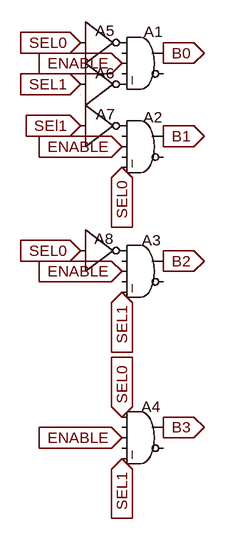
[diagram p0: schematic decoder_with_enable_2x4.asc]
decoder_with_enable_2x4.asc, the LTspice schematic file:
Version 4
SHEET 1 880 692
FLAG 176 -64 SEL0
IOPIN 176 -64 In
FLAG 240 128 SEL0
IOPIN 240 128 In
FLAG 176 256 SEL0
IOPIN 176 256 In
FLAG 240 512 SEL0
IOPIN 240 512 In
FLAG 176 0 SEL1
IOPIN 176 0 In
FLAG 176 64 SEl1
IOPIN 176 64 In
FLAG 240 320 SEL1
IOPIN 240 320 In
FLAG 240 576 SEL1
IOPIN 240 576 In
FLAG 240 -32 ENABLE
IOPIN 240 -32 In
FLAG 240 96 ENABLE
IOPIN 240 96 In
FLAG 240 288 ENABLE
IOPIN 240 288 In
FLAG 240 544 ENABLE
IOPIN 240 544 In
FLAG 304 -48 B0
IOPIN 304 -48 Out
FLAG 304 80 B1
IOPIN 304 80 Out
FLAG 304 272 B2
IOPIN 304 272 Out
FLAG 304 528 B3
IOPIN 304 528 Out
SYMBOL Digital\\and 272 -96 R0
WINDOW 0 2 15 Left 2
SYMATTR InstName A1
SYMBOL Digital\\and 272 32 R0
WINDOW 0 1 19 Left 2
SYMATTR InstName A2
SYMBOL Digital\\and 272 224 R0
WINDOW 0 -1 16 Left 2
SYMATTR InstName A3
SYMBOL Digital\\and 272 480 R0
WINDOW 0 -2 16 Left 2
SYMATTR InstName A4
SYMBOL Digital\\inv 176 -128 R0
WINDOW 0 23 46 Left 2
SYMATTR InstName A5
SYMBOL Digital\\inv 176 -64 R0
WINDOW 0 23 47 Left 2
SYMATTR InstName A6
SYMBOL Digital\\inv 176 0 R0
WINDOW 0 24 46 Left 2
SYMATTR InstName A7
SYMBOL Digital\\inv 176 192 R0
WINDOW 0 22 46 Left 2
SYMATTR InstName A8

The netlist it stands for:
* decoder_with_enable_2x4.asc
A1 P001 0 ENABLE 0 P002 0 B0 0 AND
A2 P003 0 ENABLE 0 SEL0 0 B1 0 AND
A3 P004 0 ENABLE 0 SEL1 0 B2 0 AND
A4 SEL0 0 ENABLE 0 SEL1 0 B3 0 AND
A5 SEL0 0 0 0 0 P001 0 0 BUF
A6 SEL1 0 0 0 0 P002 0 0 BUF
A7 SEL1 0 0 0 0 P003 0 0 BUF
A8 SEL0 0 0 0 0 P004 0 0 BUF
.backanno
.end